# EAGLE design brick_3pin_led_3x1 (EAGLE 7.3.0)
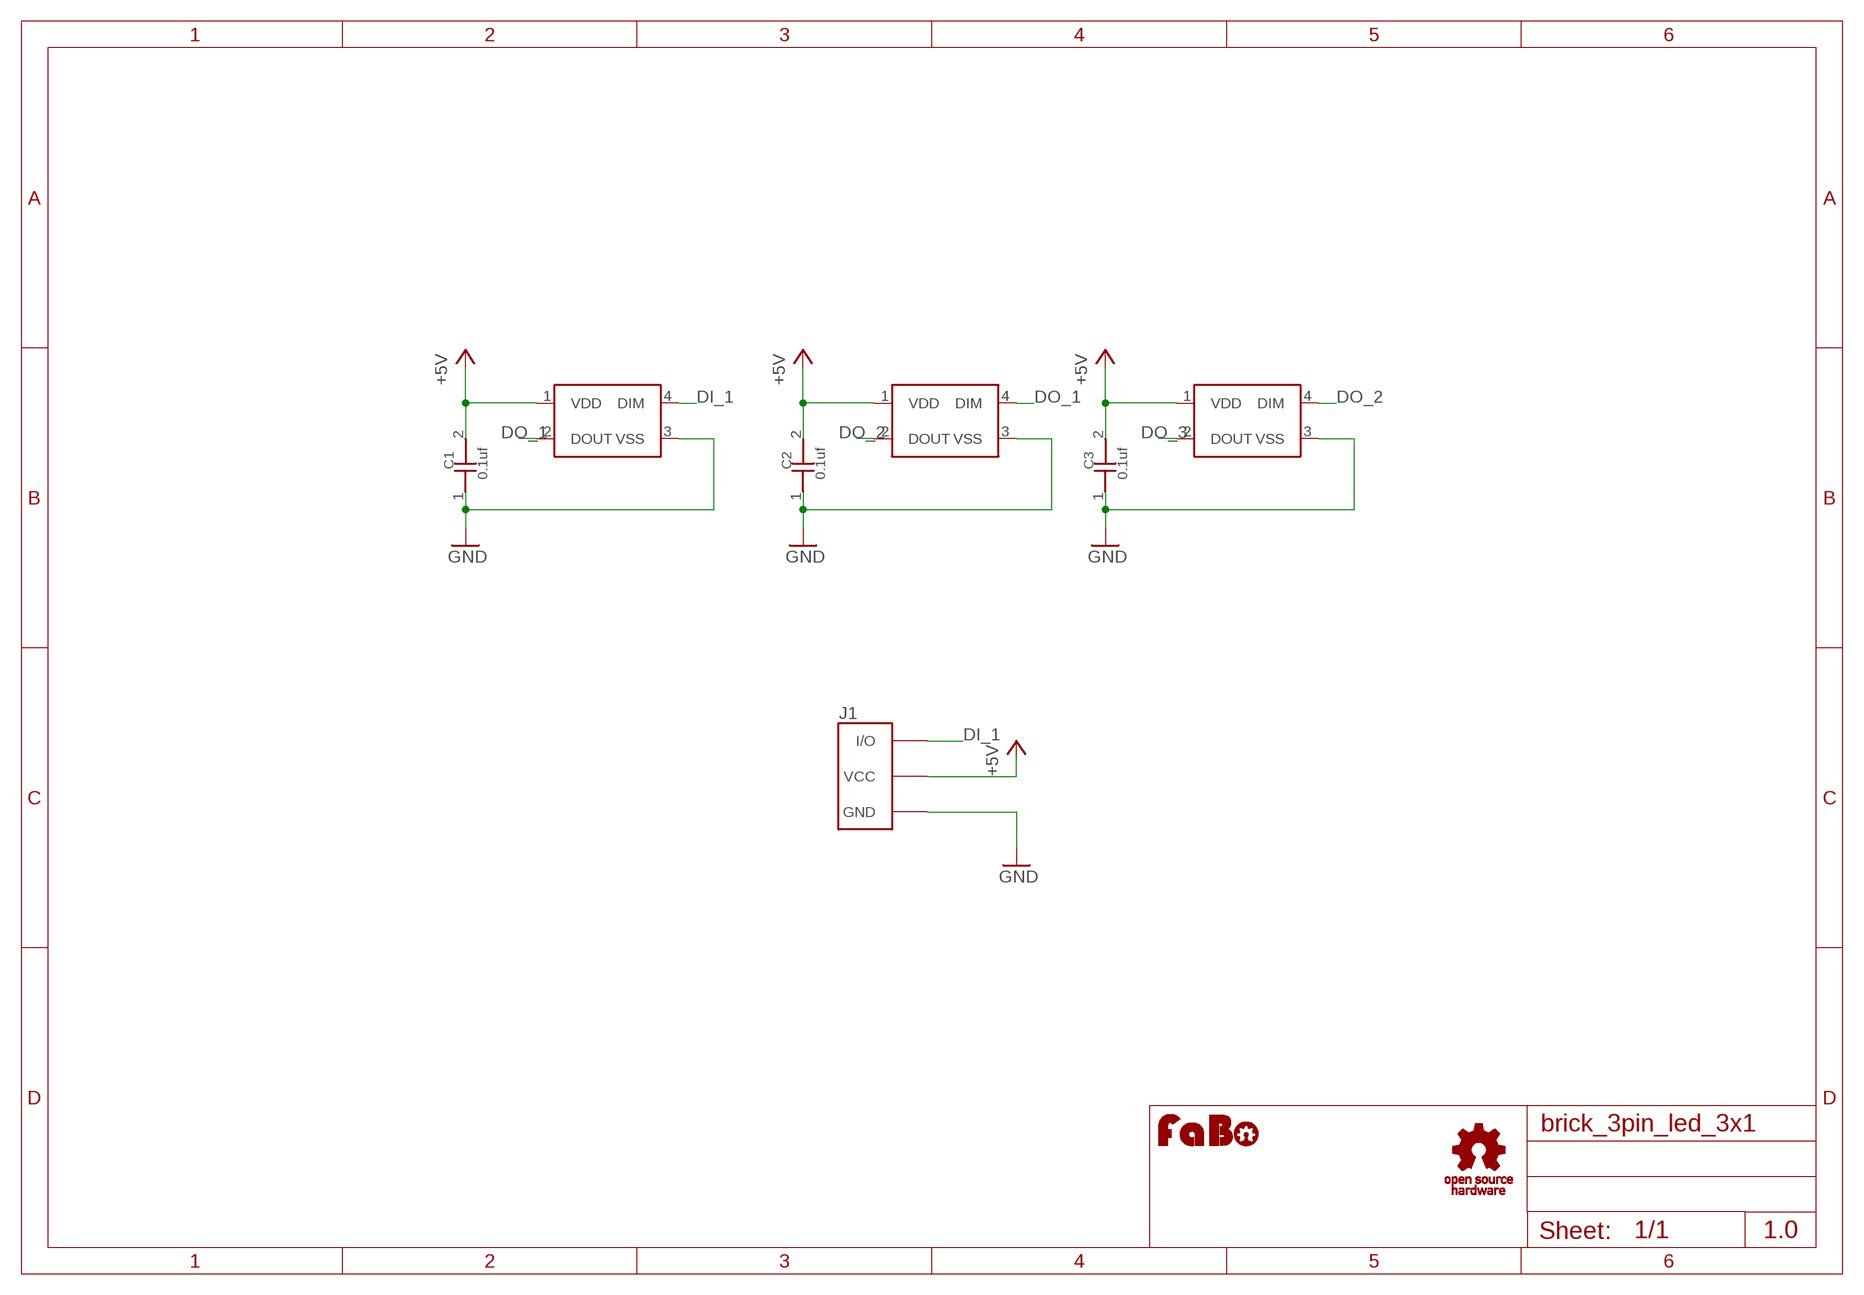
[diagram p0: schematic, sheet 1]

## Parts
C1  0.1uf  CAPACITOR0603  [0603]
C2  0.1uf  CAPACITOR0603  [0603]
C3  0.1uf  CAPACITOR0603  [0603]
J1  BRICK_3PIN_MIDDLE  [BRICK_3PIN_MIDDLE]
LED1  WS2818B  [WS2818B]
LED2  WS2818B  [WS2818B]
LED3  WS2818B  [WS2818B]
U$4  LOGO_FABO-M  [LOGO_FABO_M]
U$5  LOGO_OSHW_T-M  [LOGO_OSHW_T_M]

## Nets
+5V: C1.2 C2.2 C3.2 J1.VCC LED1.1(VDD) LED2.1(VDD) LED3.1(VDD)
DI_1: J1.IN/OUT(I/O) LED1.4(DIM)
DO_1: LED1.2(DOUT) LED2.4(DIM)
DO_2: LED2.2(DOUT) LED3.4(DIM)
DO_3: LED3.2(DOUT)
GND: C1.1 C2.1 C3.1 J1.GND LED1.3(VSS) LED2.3(VSS) LED3.3(VSS)

## Notes on the sheet
- 1.0

## Library data of the parts
C1-C3 = GClue-Capacitor:CAPACITOR
J1 = GClue:BRICK_3PIN: FaBo Brick 3pin
LED1-LED3 = GClue-LED:WS2818B
U$4 = FaBo:LOGO_FABO
U$5 = GClue:LOGO_OSHW_T

## Board
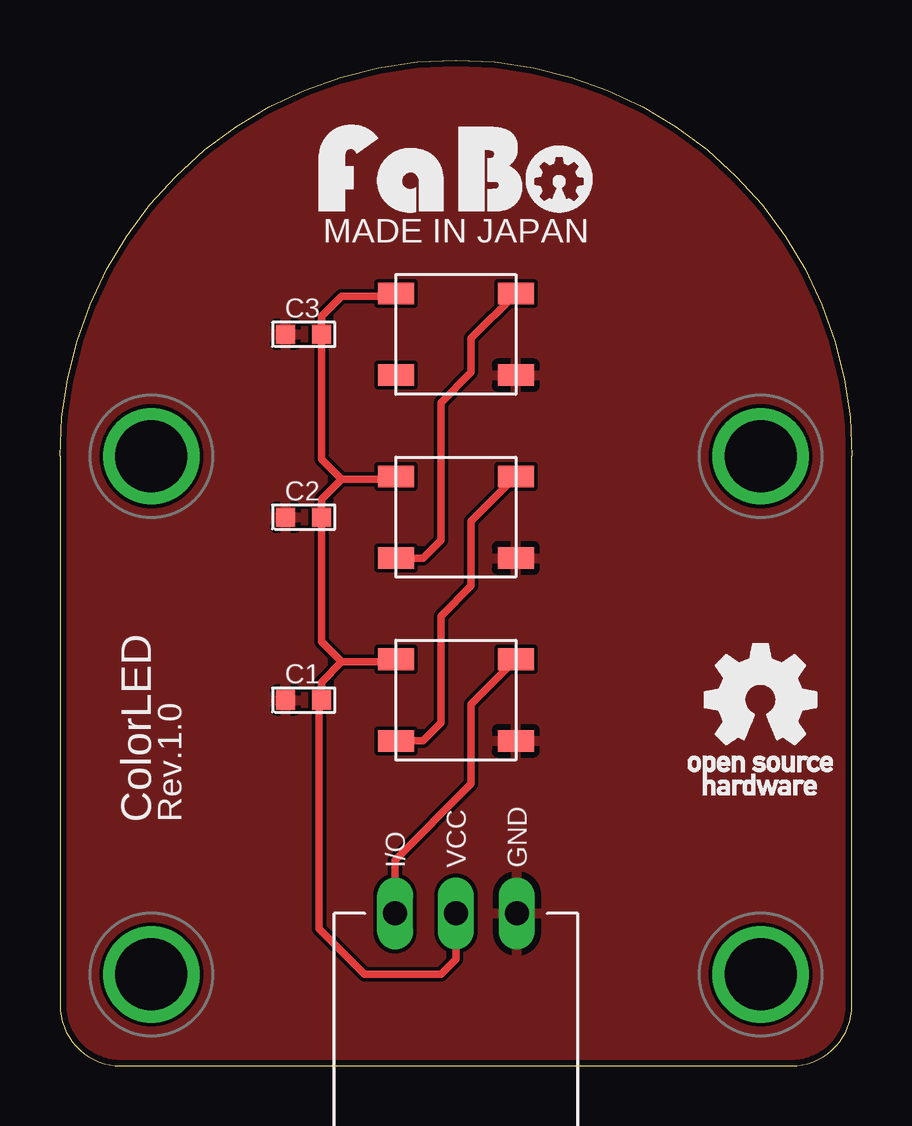
[diagram p1: board, top side]
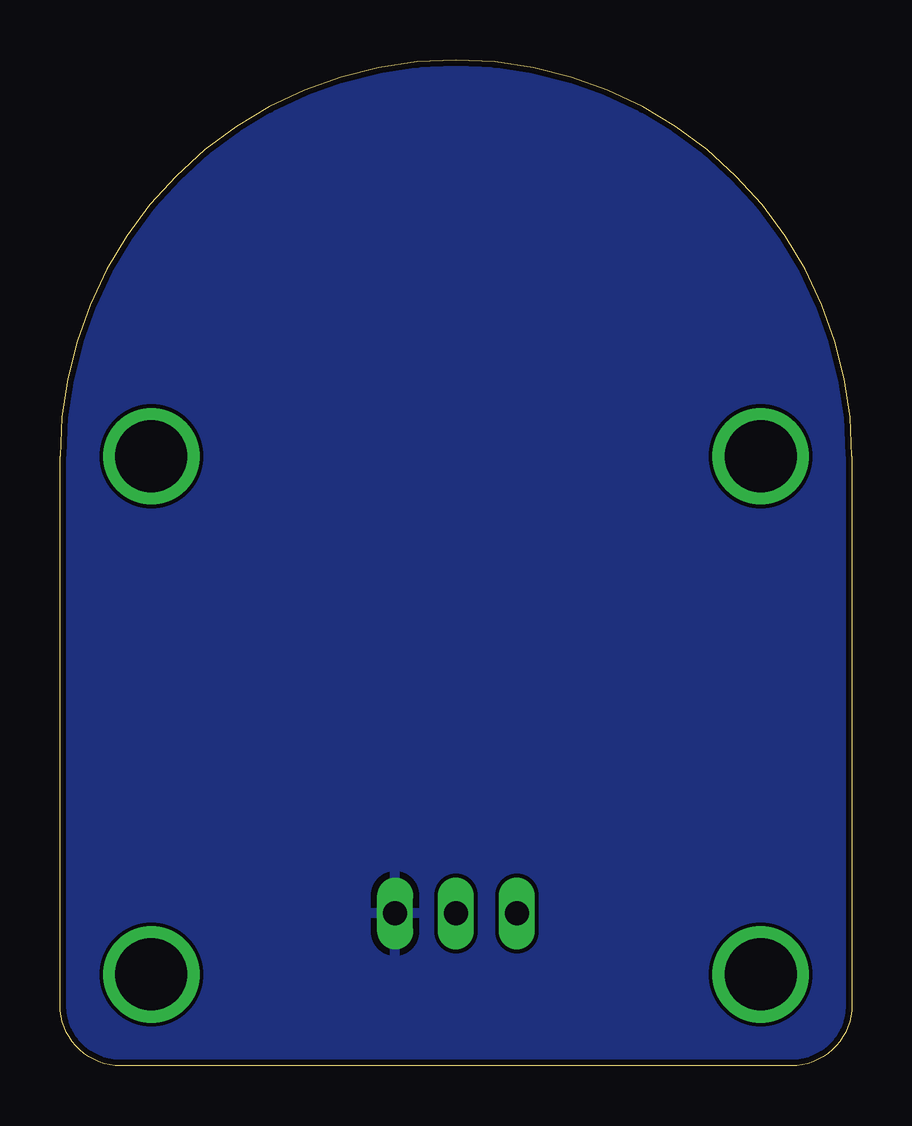
[diagram p2: board, bottom side, seen from below]

Size 33.02 x 41.91 mm. Coordinates in mm from the lower left corner, seen from the top.
Copper layers (1*16): Top 0.035mm / dielectric 1.5mm / Bottom 0.035mm
Design rules "Elecrow_2-layer_eagle_rule": minimum track width 6mil, minimum drill 12mil, track to track 6mil, track to pad 6mil, pad to pad 6mil, via to via 6mil, smd to smd 0mil, copper to edge 10mil, drill to drill 10mil, minimum pad ring 10mil, minimum via ring 6mil, stop-mask expansion 2mil, vias tented up to drill 100mil, thermal gap 10mil

### Footprints (pad centres in the part's own frame; a part is rotated, then mirrored left to right if it is on the bottom)
0603 = smd 0.8 x 0.8: 1 -0.75,0; 2 0.75,0
BRICK_3PIN_MIDDLE = drill 1 long: GND 2.54,-8.89; IN/OUT -2.54,-8.89; VCC 0,-8.89 | drill 3 pad 3.81: P$5 -12.7,10.16; P$6 12.7,10.16; P$7 -12.7,-11.43; P$8 12.7,-11.43
WS2818B = smd 1.5 x 0.9: 1 -2.5,1.7; 2 -2.5,-1.7; 3 2.5,-1.7; 4 2.5,1.7

### Placement (x,y rotation side)
C1  10.16,15.24 0 top
C2  10.16,22.86 0 top
C3  10.16,30.48 0 top
J1  16.51,15.24 0 top
LED1  16.51,15.24 0 top
LED2  16.51,22.86 0 top
LED3  16.51,30.48 0 top
U$4  16.51,35.56 0 top
U$5  29.21,15.24 0 top

### Tracks (layer width: path | path; a pad name or v marks a point on that pad's centre or on a via)
+5V
  Top 0.305: J1.VCC 16.51,4.45 15.88,3.81 12.7,3.81 10.79,5.71 10.79,15.12 C1.2 10.91,15.99 11.75,16.83 | 11.75,16.83 13.9,16.83 LED1.1 | 11.75,16.83 10.91,17.66 C2.2 10.91,23.61 11.75,24.45 | 11.75,24.45 13.9,24.45 LED2.1 | 11.75,24.45 10.91,25.29 C3.2 10.91,31.23 11.75,32.07 13.9,32.07 LED3.1
DI_1
  Top 0.305: J1.IN/OUT 13.97,8.57 17.14,11.75 17.14,15.07 LED1.4
DO_1
  Top 0.305: LED1.2 15.13,13.54 15.88,14.29 15.88,18.73 17.14,20 17.14,22.7 LED2.4
DO_2
  Top 0.305: LED2.2 15.13,21.16 15.88,21.91 15.88,27.62 17.14,28.89 17.14,30.32 LED3.4
GND
  pour Bottom: -1.27,-1.27 34.29,-1.27 34.29,43.18 -1.27,43.18
  pour Top: -1.27,-1.27 34.29,-1.27 34.29,43.18 -1.27,43.18

### Text on the board
tPlace: MADE IN JAPAN | ColorLED | Rev.1.0